# EAGLE design display (EAGLE 7.4.0)
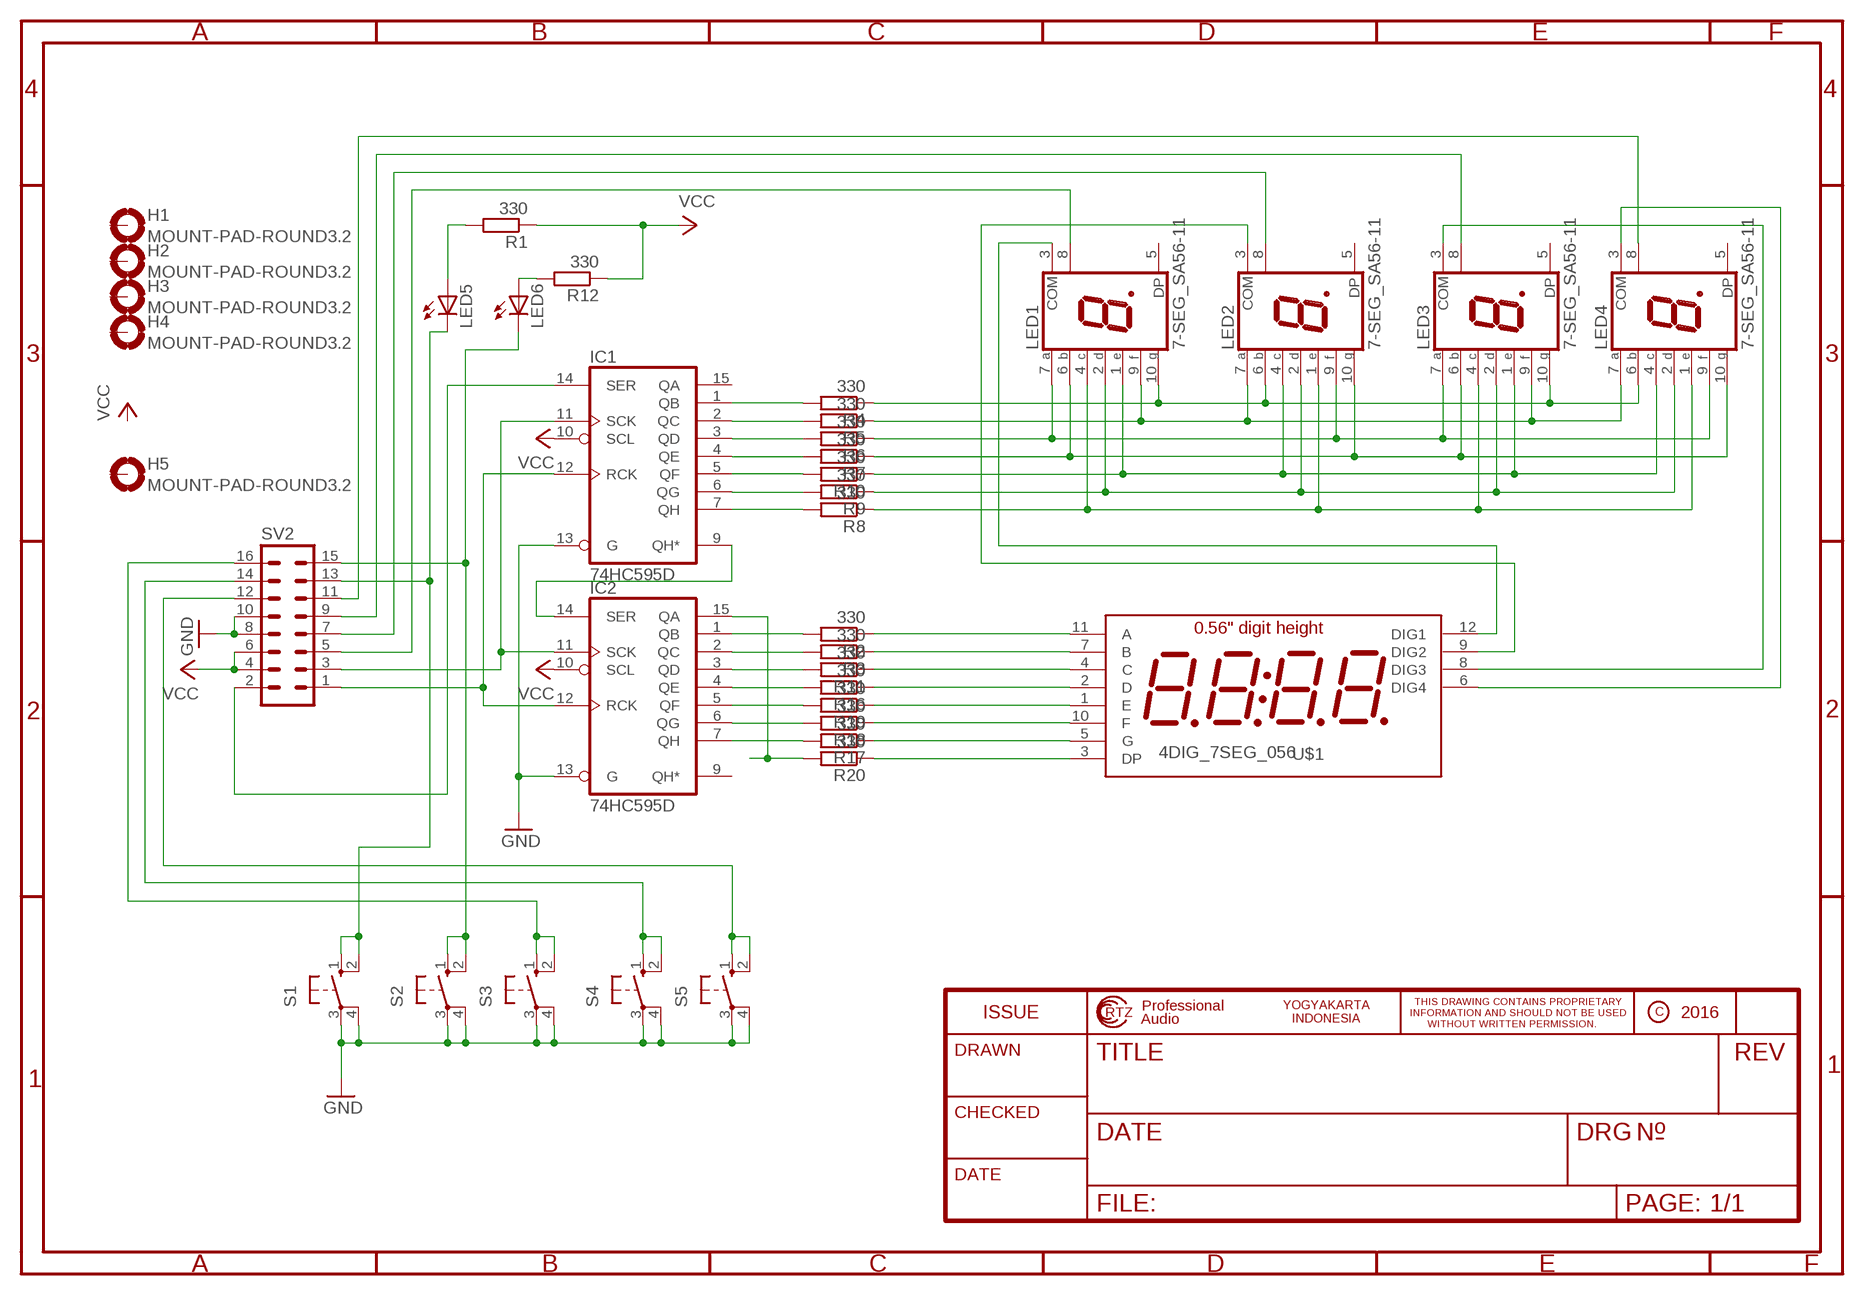
[diagram p0: schematic, sheet 1]

## Parts
H1  MOUNT-PAD-ROUND3.2  [3,2-PAD]
H2  MOUNT-PAD-ROUND3.2  [3,2-PAD]
H3  MOUNT-PAD-ROUND3.2  [3,2-PAD]
H4  MOUNT-PAD-ROUND3.2  [3,2-PAD]
H5  MOUNT-PAD-ROUND3.2  [3,2-PAD]
IC1  74HC595D  [SO16]
IC2  74HC595D  [SO16]
LED1  7-SEG_SA56-11  [SA56-11]
LED2  7-SEG_SA56-11  [SA56-11]
LED3  7-SEG_SA56-11  [SA56-11]
LED4  7-SEG_SA56-11  [SA56-11]
LED5  LED5MM  [LED5MM]
LED6  LED5MM  [LED5MM]
R1  330  R-EU_0207/7  [0207/7]
R2  330  R-EU_0207/7  [0207/7]
R3  330  R-EU_0207/7  [0207/7]
R4  330  R-EU_0207/7  [0207/7]
R5  330  R-EU_0207/7  [0207/7]
R6  330  R-EU_0207/7  [0207/7]
R7  330  R-EU_0207/7  [0207/7]
R8  330  R-EU_0207/7  [0207/7]
R9  330  R-EU_0207/7  [0207/7]
R10  330  R-EU_0207/7  [0207/7]
R11  330  R-EU_0207/7  [0207/7]
R12  330  R-EU_0207/7  [0207/7]
R16  330  R-EU_0207/7  [0207/7]
R17  330  R-EU_0207/7  [0207/7]
R18  330  R-EU_0207/7  [0207/7]
R19  330  R-EU_0207/7  [0207/7]
R20  330  R-EU_0207/7  [0207/7]
S1  40-XX  [B3F-40XX]
S2  40-XX  [B3F-40XX]
S3  40-XX  [B3F-40XX]
S4  40-XX  [B3F-40XX]
S5  40-XX  [B3F-40XX]
SV2  MA08-2W  [MA08-2W]
U$1  4DIG_7SEG_056  [4DIG_7SEG_056]

## Nets
GND: IC1.13(G) IC2.13(G) S1.3(P) S1.4(P1) S2.3(P) S2.4(P1) S3.3(P) S3.4(P1) S4.3(P) S4.4(P1) S5.3(P) S5.4(P1) SV2.8 SV2.10
N$1: IC1.2(QC) R5.2
N$2: LED1.7(A) LED2.9(F) LED3.7(A) LED4.9(F) R6.1
N$3: LED1.1(E) LED2.4(C) LED3.1(E) LED4.4(C) R10.1
N$4: LED1.2(D) LED2.2(D) LED3.2(D) LED4.2(D) R9.1
N$5: LED1.6(B) LED2.10(G) LED3.6(B) LED4.10(G) R7.1
N$6: LED1.3(COM) U$1.12(DIG1)
N$7: LED2.3(COM) U$1.9(DIG2)
N$8: LED1.4(C) LED2.1(E) LED3.4(C) LED4.1(E) R8.1
N$9: IC2.2(QC) R3.2
N$10: IC2.3(QD) R11.2
N$11: IC1.11(SCK) IC2.11(SCK) SV2.3
N$12: IC1.3(QD) R6.2
N$13: IC1.12(RCK) IC2.12(RCK) SV2.1
N$14: LED3.3(COM) U$1.8(DIG3)
N$15: LED4.3(COM) U$1.6(DIG4)
N$16: IC1.4(QE) R7.2
N$17: IC1.5(QF) R10.2
N$18: IC1.6(QG) R9.2
N$19: IC1.7(QH) R8.2
N$20: IC1.1(QB) R4.2
N$21: IC1.14(SER) SV2.2
N$22: IC2.4(QE) R16.2
N$23: IC2.6(QG) R18.2
N$24: LED4.8(COM) SV2.11
N$25: LED2.8(COM) SV2.7
N$26: LED3.8(COM) SV2.9
N$27: LED1.10(G) LED2.6(B) LED3.10(G) LED4.6(B) R4.1
N$28: LED1.8(COM) SV2.5
N$29: LED5.A R1.2
N$30: LED6.A R12.2
N$33: IC2.5(QF) R19.2
N$34: LED1.9(F) LED2.7(A) LED3.9(F) LED4.7(A) R5.1
N$35: IC2.7(QH) R17.2
N$36: IC2.1(QB) R2.2
N$37: R2.1 U$1.11(A)
N$38: R3.1 U$1.7(B)
N$39: R11.1 U$1.4(C)
N$40: R16.1 U$1.2(D)
N$41: R17.1 U$1.5(G)
N$42: R18.1 U$1.10(F)
N$43: R19.1 U$1.1(E)
N$44: R20.1 U$1.3(DP)
N$45: IC2.15(QA) R20.2
N$46: LED5.K(C) S1.1(S) S1.2(S1) SV2.13
N$47: LED6.K(C) S2.1(S) S2.2(S1) SV2.15
N$48: S3.1(S) S3.2(S1) SV2.16
N$49: S4.1(S) S4.2(S1) SV2.14
N$50: S5.1(S) S5.2(S1) SV2.12
N$53: IC1.9(QH*) IC2.14(SER)
VCC: IC1.10(SCL) IC2.10(SCL) R1.1 R12.1 SV2.4 SV2.6
Unconnected: H1.B3,2(MOUNT) H2.B3,2(MOUNT) H3.B3,2(MOUNT) H4.B3,2(MOUNT) H5.B3,2(MOUNT) IC1.15(QA) IC2.9(QH*) LED1.5(DP) LED2.5(DP) LED3.5(DP) LED4.5(DP)

## Power pins joined to a net without a drawn wire
GND: IC1.8(GND) IC2.8(GND)
VCC: IC1.16(VCC) IC2.16(VCC)

## Library data of the parts
H1-H5 = holes:MOUNT-PAD-ROUND: MOUNTING PAD, round
IC1 IC2 = 74xx-eu:74*595: 8-bit SHIFT REGISTER, output latch
LED1-LED4 = display-kingbright:7-SEG_: Kingbright 14.2mm (0.56 INCH) SINGLE DIGIT NUMERIC DUISPLAY Source: SA56-11EWA(Ver1189471036.pdf; OC_FARNELL: unknown; OC_NEWARK: unknown
LED5 LED6 = led:LED: LED OSRAM: - CHIPLED LG R971, LG N971, LY N971, LG Q971, LY Q971, LO R971, LY R971 LH N974, LH R974 LS Q976, LO Q976, LY Q976 LO Q996 - Hyper CHIPLED LW Q18S LB Q993, LB Q99A, LB R99A - SideLED LS A670, LO A670, LY A670, LG A670, LP A670 LB A673, LV A673, LT A673, LW A673 LH A674 LY A675 LS A676, LA A676, LO A676, LY A676, LW A676 LS A679, LY A679, LG A679 - Hyper Micro SIDELED® LS Y876, LA Y876, LO Y876, LY Y876 LT Y87S - SmartLED LW L88C, LW L88S LB L89C, LB L89S, LG L890 LS L89K, LO L89K, LY L89K LS L896, LA L896, LO L896, LY L896 - TOPLED LS T670, LO T670, LY T670, LG T670, LP T670 LSG T670, LSP T670, LSY T670, LOP T670, LYG T670 LG T671, LOG T671, LSG T671 LB T673, LV T673, LT T673, LW T673 LH T674 LS T676, LA T676, LO T676, LY T676, LB T676, LH T676, LSB T676, LW T676 LB T67C, LV T67C, LT T67C, LS T67K, LO T67K, LY T67K, LW E67C LS E67B, LA E67B, LO E67B, LY E67B, LB E67C, LV E67C, LT E67C LW T67C LS T679, LY T679, LG T679 LS T770, LO T770, LY T770, LG T770, LP T770 LB T773, LV T773, LT T773, LW T773 LH T774 LS E675, LA E675, LY E675, LS T675 LS T776, LA T776, LO T776, LY T776, LB T776 LHGB T686 LT T68C, LB T68C - Hyper Mini TOPLED® LB M676 - Mini TOPLED Santana® LG M470 LS M47K, LO M47K, LY M47K Source: http://www.osram.convergy.de LUXEON: - LUMILED® LXK2-PW12-R00, LXK2-PW12-S00, LXK2-PW14-U00, LXK2-PW14-V00 LXK2-PM12-R00, LXK2-PM12-S00, LXK2-PM14-U00 LXK2-PE12-Q00, LXK2-PE12-R00, LXK2-PE12-S00, LXK2-PE14-T00, LXK2-PE14-U00 LXK2-PB12-K00, LXK2-PB12-L00, LXK2-PB12-M00, LXK2-PB14-N00, LXK2-PB14-P00, LXK2-PB14-Q00 LXK2-PR12-L00, LXK2-PR12-M00, LXK2-PR14-Q00, LXK2-PR14-R00 LXK2-PD12-Q00, LXK2-PD12-R00, LXK2-PD12-S00 LXK2-PH12-R00, LXK2-PH12-S00 LXK2-PL12-P00, LXK2-PL12-Q00, LXK2-PL12-R00 Source: www.luxeon.com KINGBRIGHT: KA-3528ASYC Source: www.kingbright.com
R1-R12 R16-R20 = rcl:R-EU_: RESISTOR, European symbol
S1-S5 = switch-omron:40-XX: OMRON SWITCH; MF: OMRON COMPONENTS USA; MPN: B3F-4000; OC_FARNELL: 176434; OC_NEWARK: 36K3105
SV2 = con-lstb:MA08-2W: PIN HEADER; OC_FARNELL: unknown; OC_NEWARK: unknown
U$1 = 7-seg-disp:4DIG_7SEG_056

## Board
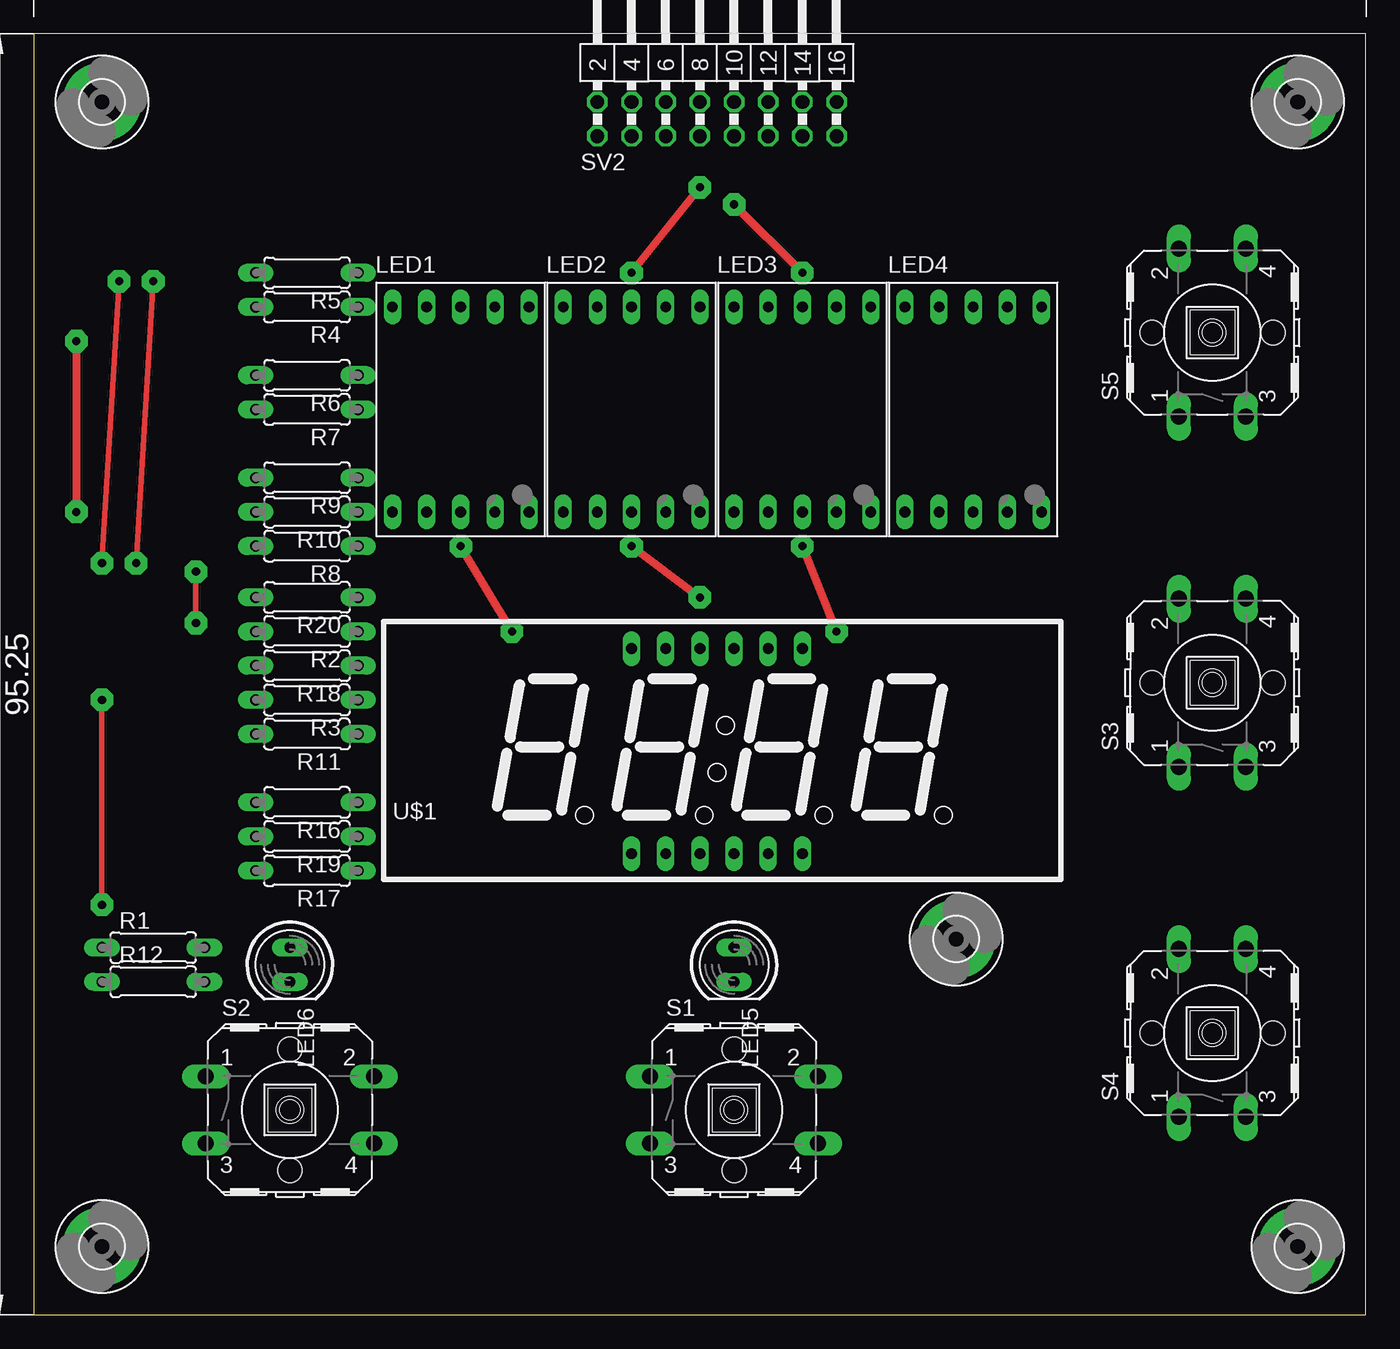
[diagram p1: board, top side]
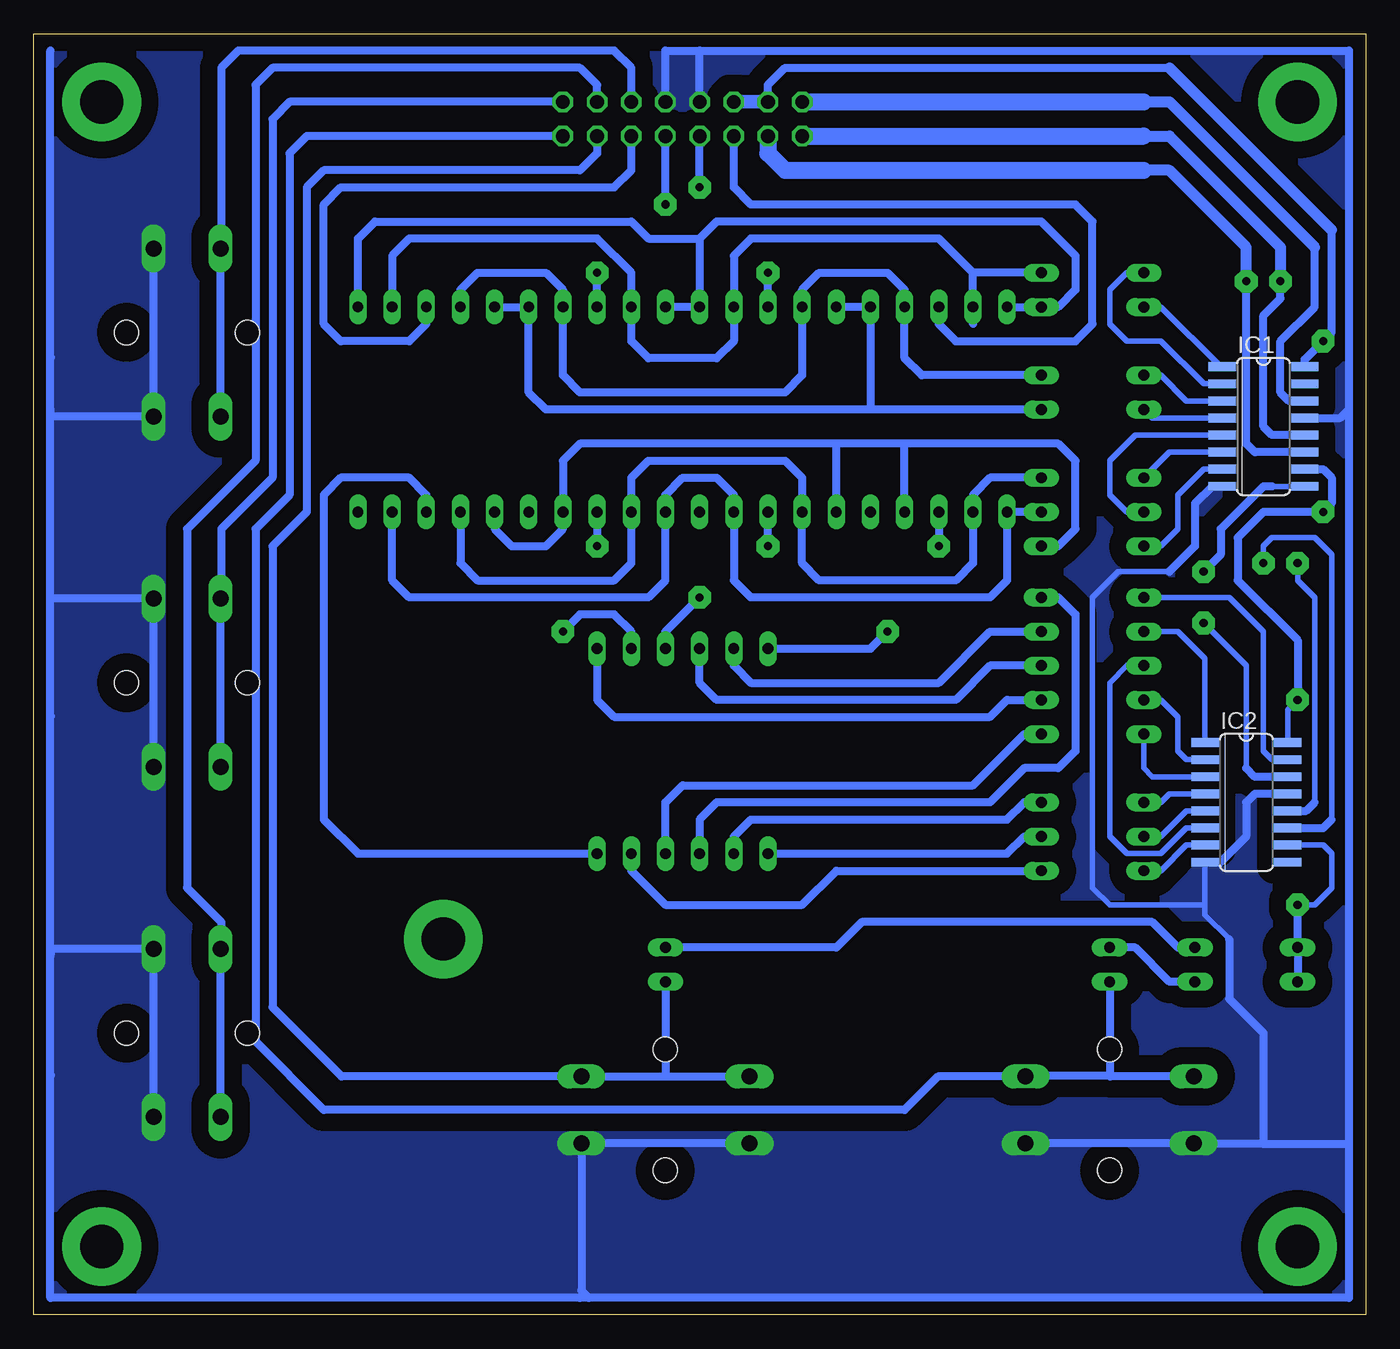
[diagram p2: board, bottom side, seen from below]

Size 99.04 x 95.25 mm. Coordinates in mm from the lower left corner, seen from the top.
Outline: 0,0 99.04,0 99.04,95.25 0,95.25 0,0
Copper layers (1*16): Top 0.035mm / dielectric 1.5mm / Bottom 0.035mm
Design rules "default": minimum track width 10mil, minimum drill 24mil, track to track 8mil, track to pad 8mil, pad to pad 8mil, via to via 8mil, smd to smd 8mil, copper to edge 40mil, drill to drill 8mil, minimum pad ring 10mil, minimum via ring 8mil, stop-mask expansion 4mil, vias tented up to drill 0mil, thermal gap 10mil

### Footprints (pad centres in the part's own frame; a part is rotated, then mirrored left to right if it is on the bottom)
3,2-PAD = drill 3.2 pad 5.842: B3,2 0,0
SO16 = smd 0.66 x 2.032: 1 -4.445,-3.073; 2 -3.175,-3.073; 3 -1.905,-3.073; 4 -0.635,-3.073; 5 0.635,-3.073; 6 1.905,-3.073; 7 3.175,-3.073; 8 4.445,-3.073; 9 4.445,3.073; 10 3.175,3.073; 11 1.905,3.073; 12 0.635,3.073; 13 -0.635,3.073; 14 -1.905,3.073; 15 -3.175,3.073; 16 -4.445,3.073
SA56-11 = drill 0.8 long: 1 -5.08,-7.62; 2 -2.54,-7.62; 3 0,-7.62; 4 2.54,-7.62; 5 5.08,-7.62; 6 5.08,7.62; 7 2.54,7.62; 8 0,7.62; 9 -2.54,7.62; 10 -5.08,7.62
LED5MM = drill 0.813 long: A -1.27,0; K 1.27,0
0207/7 = drill 0.813 long: 1 -3.81,0; 2 3.81,0
B3F-40XX = drill 1.194 long: 1 -6.248,2.489; 2 6.248,2.489; 3 -6.248,-2.489; 4 6.248,-2.489 | hole 1.803: 0,-4.496; 0,4.496
MA08-2W = drill 1.016 octagon: 1 -8.89,-1.27; 2 -8.89,1.27; 3 -6.35,-1.27; 4 -6.35,1.27; 5 -3.81,-1.27; 6 -3.81,1.27; 7 -1.27,-1.27; 8 -1.27,1.27; 9 1.27,-1.27; 10 1.27,1.27; 11 3.81,-1.27; 12 3.81,1.27; 13 6.35,-1.27; 14 6.35,1.27; 15 8.89,-1.27; 16 8.89,1.27
4DIG_7SEG_056 = drill 0.8 long: 1 19.05,2.54; 2 21.59,2.54; 3 24.13,2.54; 4 26.67,2.54; 5 29.21,2.54; 6 31.75,2.54; 7 31.75,17.78; 8 29.21,17.78; 9 26.67,17.78; 10 24.13,17.78; 11 21.59,17.78; 12 19.05,17.78

### Placement (x,y rotation side)
H1  5.08,5.08 0 top
H2  93.98,5.08 0 top
H3  5.08,90.17 0 top
H4  93.98,90.17 0 top
H5  68.58,27.94 0 top
IC1  7.62,66.04 270 bottom
IC2  8.89,38.1 270 bottom
LED1  31.75,67.31 0 top
LED2  44.45,67.31 0 top
LED3  57.15,67.31 0 top
LED4  69.85,67.31 0 top
LED5  52.07,26.04 270 top
LED6  19.05,26.04 270 top
R1  8.89,27.3 0 top
R2  20.32,50.8 180 top
R3  20.32,45.72 180 top
R4  20.32,74.93 180 top
R5  20.32,77.47 180 top
R6  20.32,69.85 180 top
R7  20.32,67.31 180 top
R8  20.32,57.15 180 top
R9  20.32,62.23 180 top
R10  20.32,59.69 180 top
R11  20.32,43.18 180 top
R12  8.89,24.77 0 top
R16  20.32,38.1 180 top
R17  20.32,33.02 180 top
R18  20.32,48.26 180 top
R19  20.32,35.56 180 top
R20  20.32,53.34 180 top
S1  52.07,15.24 0 top
S2  19.05,15.24 0 top
S3  87.63,46.99 90 top
S4  87.63,20.95 90 top
S5  87.63,73.03 90 top
SV2  50.8,88.9 0 top
U$1  25.4,31.75 0 top

### Tracks (layer width: path | path; a pad name or v marks a point on that pad's centre or on a via)
GND
  Bottom 0.406: IC2.8 11.96,30.48 | 11.96,30.48 11.96,29.74 10.16,27.94 | 11.96,30.48 19.05,30.48 20.32,31.75 20.32,53.34 18.41,55.24 14.61,55.24
  Bottom 0.61: S5.4 S5.3 97.69,66.78 97.79,67.31 | 97.74,71.17 97.79,71.12 | 97.79,71.12 97.79,93.98 | 49.53,93.98 52.07,93.98 SV2.10 | 49.53,93.98 1.27,93.98 1.27,67.31 | 1.27,67.31 1.27,12.7 | 1.27,12.7 1.27,1.27 57.78,1.27 | 57.78,1.27 58.42,1.27 | 58.42,1.27 97.79,1.27 97.79,17.78 | 97.79,17.78 97.79,26.67 | 97.79,26.67 97.79,44.45 | 97.79,44.45 97.79,53.34 | 97.79,53.34 97.79,67.31 | 97.79,67.31 97.79,71.12 | S3.3 S3.4 97.69,53.24 97.79,53.34 | 97.74,44.5 97.79,44.45 | 97.74,17.83 97.79,17.78 | 58.32,1.37 58.42,1.27 | S2.4 S2.3 12.75,12.7 7.62,12.7 | S1.3 S1.4 58.32,1.8 57.78,1.27 | 1.27,12.7 1.32,12.75 1.37,12.7 7.62,12.7 | SV2.8 49.53,93.98 | 97.79,26.67 97.69,27.2 S4.4 S4.3 | IC1.13 1.91,66.67 1.27,67.31 | IC2.13 8.26,38.73 8.89,38.1 8.89,35.56 10.79,33.66 IC2.8 | IC1.8 11.43,61.59 12.7,60.33 12.7,57.15 14.61,55.24 | 10.16,27.94 10.16,23.5 7.62,20.95 7.62,12.7
  pour Bottom (isolate 1.27, no thermals): 0,95.25 99.06,95.25 99.06,0 0,0
N$1
  Bottom 0.406: IC1.2 12.06,69.22 15.24,72.39 17.78,72.39 19.05,73.66 19.05,76.2 17.78,77.47 R5.2
N$2
  Bottom 0.61: R6.1 33.02,69.85 34.29,71.12 LED1.7 34.29,76.2 35.56,77.47 40.64,77.47 41.91,76.2 LED2.9 41.91,69.85 43.18,68.58 58.42,68.58 59.69,69.85 LED3.7 59.69,76.2 60.96,77.47 66.04,77.47 67.31,76.2 LED4.9
N$3
  Bottom 0.61: R10.1 LED1.1 26.67,54.61 27.94,53.34 45.72,53.34 46.99,54.61 LED2.4 46.99,60.96 48.26,62.23 50.8,62.23 52.07,60.96 LED3.1 52.07,54.61 53.34,53.34 71.12,53.34 72.39,54.61 LED4.4
N$4
  Bottom 0.61: LED4.2 67.31,55.88 66.04,54.61 55.88,54.61 54.61,55.88 LED3.2 54.61,62.23 53.34,63.5 43.18,63.5 41.91,62.23 LED2.2 41.91,55.88 40.64,54.61 30.48,54.61 29.21,55.88 LED1.2 29.21,60.96 27.94,62.23 R9.1
N$5
  Bottom 0.61: LED4.10 LED3.6 62.23,68.58 60.96,67.31 36.83,67.31 | LED2.10 LED1.6 36.83,67.31 | R7.1 36.83,67.31
N$6  (via drill 0.6 pad 1.68)
  Top 0.61: v35.56,50.8 v31.75,57.15
  Bottom 0.61: LED1.3 v31.75,57.15 | U$1.12 36.83,49.53 v35.56,50.8
N$7  (via drill 0.6 pad 1.68)
  Top 0.61: v49.53,53.34 v44.45,57.15
  Bottom 0.61: v44.45,57.15 LED2.3 | U$1.9 52.07,50.8 v49.53,53.34
N$8
  Bottom 0.61: LED4.1 64.77,58.42 63.5,57.15 60.96,57.15 59.69,58.42 LED3.4 59.69,63.5 58.42,64.77 39.37,64.77 | R8.1 22.86,57.15 21.59,58.42 21.59,63.5 22.86,64.77 34.29,64.77 | 34.29,64.77 39.37,64.77 | LED1.4 34.29,64.77 | LED2.1 39.37,64.77
N$9
  Bottom 0.406: IC2.2 13.34,41.27 13.97,41.91 13.97,44.45 15.24,45.72 R3.2
N$10
  Bottom 0.406: IC2.3 15.88,40.01 16.51,40.64 R11.2
N$11  (via drill 0.6 pad 1.68)
  Top 0.406: v7.62,55.88 v8.89,76.83
  Bottom 0.406: 2.54,36.83 2.54,56.52 3.81,57.78 6.99,57.78 7.62,57.15 v7.62,55.88
  Bottom 0.61: IC1.11 8.26,64.14 8.89,64.77 v8.89,76.83 | IC2.11 3.17,36.2 2.54,36.83
  Bottom 0.813: v8.89,76.83 8.89,79.38 14.61,85.09 16.51,85.09
  Bottom 1.27: SV2.3 44.45,86.36 43.18,85.09 16.51,85.09
N$12
  Bottom 0.406: IC1.3 13.34,67.94 15.24,69.85 R6.2
N$13  (via drill 0.6 pad 1.68)
  Top 0.406: v5.08,55.88 v6.35,76.83
  Bottom 0.406: 3.81,38.1 3.81,53.34 5.08,54.61 v5.08,55.88
  Bottom 0.61: IC1.12 6.99,65.41 7.62,66.04 7.62,74.3 6.35,75.56 v6.35,76.83 | IC2.12 4.45,37.47 3.81,38.1
  Bottom 0.813: 16.51,87.63 14.61,87.63 6.35,79.38 v6.35,76.83
  Bottom 1.27: SV2.1 16.51,87.63
N$14  (via drill 0.6 pad 1.68)
  Top 0.61: v59.69,50.8 v57.15,57.15
  Bottom 0.61: U$1.8 54.61,50.8 55.88,52.07 58.42,52.07 v59.69,50.8 | LED3.3 v57.15,57.15
N$15
  Bottom 0.61: LED4.3 69.85,60.96 71.12,62.23 76.2,62.23 77.47,60.96 77.47,36.83 74.93,34.29 U$1.6
N$16
  Bottom 0.406: IC1.4 15.88,66.67 R7.2
N$17
  Bottom 0.406: IC1.5 17.14,65.41 19.05,63.5 19.05,60.96 17.78,59.69 R10.2
N$18
  Bottom 0.406: IC1.6 14.61,64.14 R9.2
N$19
  Bottom 0.406: IC1.7 12.06,62.87 13.97,60.96 13.97,58.42 15.24,57.15 R8.2
N$20
  Bottom 0.406: IC1.1 10.79,70.48 15.24,74.93 R4.2
N$21
  Bottom 0.61: IC1.14 5.71,67.94 6.35,68.58 6.35,72.39 3.81,74.93 3.81,79.38
  Bottom 0.813: 16.51,90.17 14.61,90.17 3.81,79.38
  Bottom 1.27: SV2.2 16.51,90.17
N$22
  Bottom 0.406: IC2.4 14.61,38.73 15.24,38.1 R16.2
N$23
  Bottom 0.406: R18.2 17.78,48.26 19.05,46.99 19.05,35.56 17.78,34.29 15.24,34.29 13.34,36.2 IC2.6
N$24
  Bottom 0.61: LED4.8 69.85,73.66 71.12,72.39 76.2,72.39 77.47,73.66 77.47,82.55 76.2,83.82 55.88,83.82 54.61,85.09 SV2.11
N$25  (via drill 0.6 pad 1.68)
  Top 0.61: v44.45,77.47 v49.53,83.82
  Bottom 0.61: LED2.8 v44.45,77.47 | v49.53,83.82 SV2.7
N$26  (via drill 0.6 pad 1.68)
  Top 0.61: v57.15,77.47 v52.07,82.55
  Bottom 0.61: LED3.8 v57.15,77.47 | v52.07,82.55 SV2.9
N$27
  Bottom 0.61: LED3.10 LED2.6 49.53,80.01 | LED1.10 R4.1 22.86,74.93 21.59,76.2 21.59,78.74 24.13,81.28 48.26,81.28 49.53,80.01 | LED4.6 74.93,80.01 73.66,81.28 54.61,81.28 53.34,80.01 49.53,80.01
N$28
  Bottom 0.61: LED1.8 31.75,73.66 30.48,72.39 21.59,72.39 20.32,73.66 20.32,81.28 21.59,82.55 45.72,82.55 46.99,83.82 SV2.5
N$29
  Bottom 0.61: R1.2 13.97,27.3 15.88,29.21 37.47,29.21 39.37,27.3 LED5.A
N$30
  Bottom 0.61: R12.2 14.61,24.77 17.14,27.3 LED6.A
N$33
  Bottom 0.406: IC2.5 13.34,37.47 15.24,35.56 R19.2
N$34
  Bottom 0.61: 29.21,73.66 LED1.9 29.21,77.47 | 29.21,77.47 31.75,80.01 45.72,80.01 46.99,78.74 LED2.7 46.99,72.39 48.26,71.12 53.34,71.12 54.61,72.39 LED3.9 54.61,77.47 57.15,80.01 71.12,80.01 72.39,78.74 LED4.7 | R5.1 29.21,77.47
N$35
  Bottom 0.406: IC2.7 13.34,34.92 15.24,33.02 R17.2
N$36
  Bottom 0.406: IC2.1 11.96,48.79 13.97,50.8 R2.2
N$37
  Bottom 0.61: U$1.11 46.99,48.26 45.72,46.99 31.75,46.99 27.94,50.8 R2.1
N$38
  Bottom 0.61: U$1.7 57.15,45.72 55.88,44.45 27.94,44.45 26.67,45.72 R3.1
N$39
  Bottom 0.61: U$1.4 52.07,38.1 50.8,39.37 29.21,39.37 25.4,43.18 R11.1
N$40
  Bottom 0.61: U$1.2 46.99,35.56 45.72,36.83 26.67,36.83 25.4,38.1 R16.1
N$41
  Bottom 0.61: U$1.5 54.61,33.02 52.07,30.48 41.91,30.48 39.37,33.02 R17.1
N$42
  Bottom 0.61: R18.1 27.94,48.26 30.48,45.72 48.26,45.72 49.53,46.99 U$1.10
N$43
  Bottom 0.61: U$1.1 26.67,34.29 25.4,35.56 R19.1
N$44
  Bottom 0.61: R20.1 22.86,53.34 21.59,52.07 21.59,41.91 22.86,40.64 25.4,40.64 27.94,38.1 48.26,38.1 49.53,36.83 U$1.3
N$45
  Bottom 0.406: R20.2 10.16,53.34 7.62,50.8 7.62,41.91 6.99,41.27 IC2.15
N$46
  Bottom 0.61: SV2.13 57.15,86.36 58.42,85.09 77.47,85.09 78.74,83.82 78.74,59.69 81.28,57.15 81.28,22.86 76.15,17.73 S1.2 52.07,17.73 | 52.07,17.73 S1.1 | LED5.K 52.07,17.73
N$47
  Bottom 0.61: SV2.15 78.74,87.63 80.01,86.36 80.01,60.96 82.55,58.42 82.55,20.32 77.47,15.24 34.29,15.24 31.8,17.73 S2.2 25.25,17.78 19.05,17.78 | LED6.K 19.05,17.78 | S2.1 19,17.73 19.05,17.78
N$48
  Bottom 0.61: SV2.16 80.01,90.17 81.28,88.9 81.28,62.23 85.09,58.42 85.09,53.29 S3.2 S3.1
N$49
  Bottom 0.61: SV2.14 57.15,91.44 58.42,92.71 81.28,92.71 82.55,91.44 82.55,63.5 87.63,58.42 87.63,31.75 85.09,29.21 85.09,26.62 S4.2 S4.1
N$50
  Bottom 0.61: SV2.12 54.61,92.71 55.88,93.98 83.82,93.98 85.09,92.71 85.09,79.96 S5.2 S5.1
N$53  (via drill 0.6 pad 1.68)
  Top 0.406: v12.06,51.44 v12.06,55.24
  Bottom 0.406: 8.89,40.64 8.89,48.26 v12.06,51.44 | IC1.9 6.99,61.59
  Bottom 0.61: IC2.14 8.26,40.01 8.89,40.64 | 6.99,61.59 7.62,61.59 10.79,58.42 10.79,56.52 v12.06,55.24
VCC  (via drill 0.6 pad 1.68)
  Top 0.406: v5.08,45.72 v5.08,30.48
  Top 0.61: v3.17,72.39 v3.17,59.69
  Bottom 0.406: IC2.10 3.17,34.92 2.54,34.29 2.54,31.75 3.81,30.48 v5.08,30.48 | IC2.16 5.82,44.98 v5.08,45.72
  Bottom 0.61: SV2.4 44.45,91.44 43.18,92.71 14.61,92.71 | 2.54,80.64 2.54,73.03 v3.17,72.39 4.55,71.02 IC1.16 | v5.08,45.72 5.08,50.16 9.53,54.61 9.53,57.78 7.62,59.69 v3.17,59.69 2.54,60.33 2.54,62.23 3.17,62.87 IC1.10 | v5.08,30.48 R1.1 R12.1
  Bottom 0.813: 14.61,92.71 2.54,80.64
  Bottom 1.016: SV2.6 SV2.4